# EAGLE design object_1 (EAGLE 7.7.0)
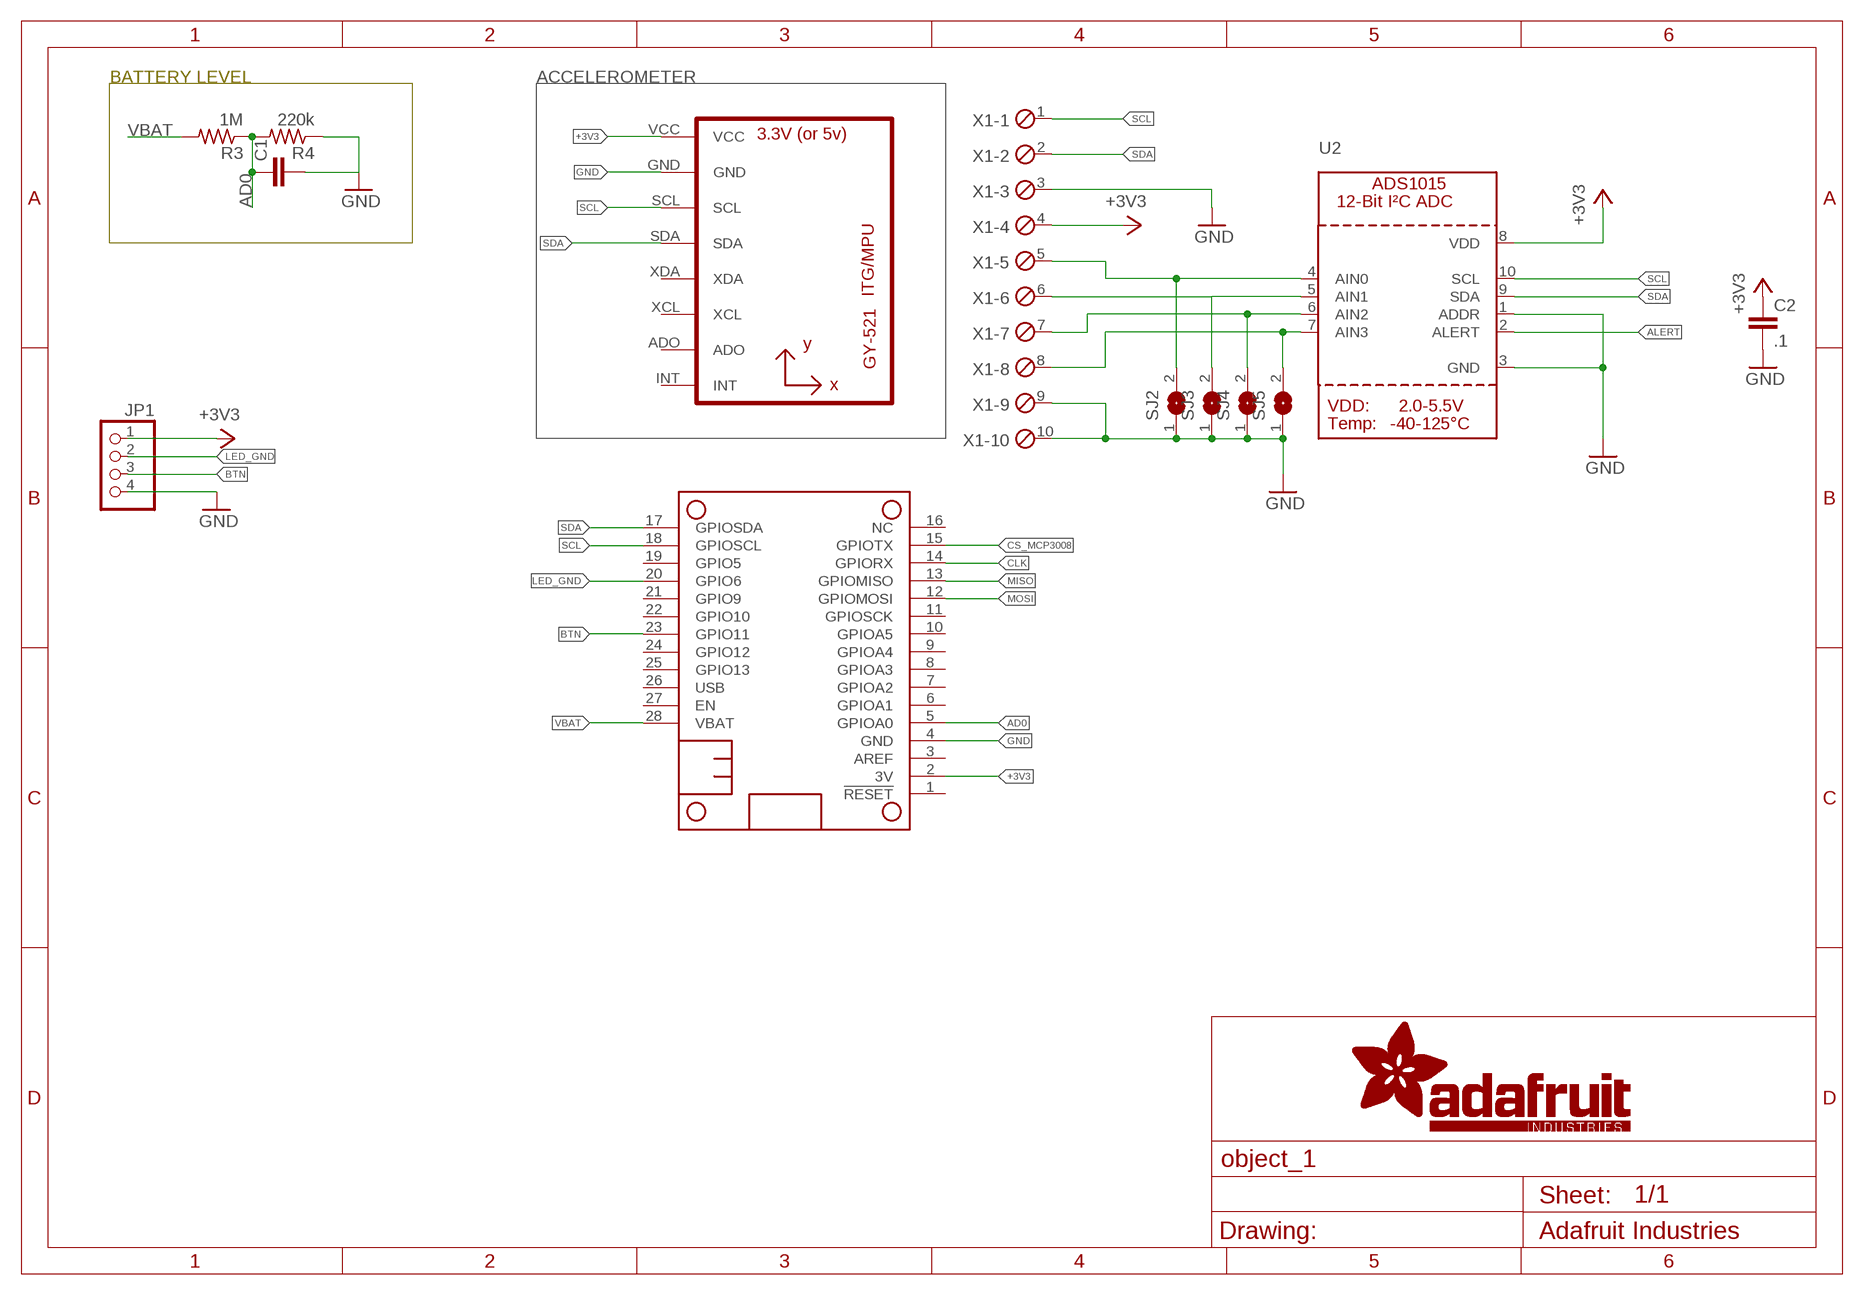
[diagram p0: schematic, sheet 1]

## Parts
C1  C-EUC0805K  [C0805K]
C2  .1  C-EUC0805K  [C0805K]
JP1  PINHD-1X4/90  [1X04/90]
MS1  FEATHERWING_NODIM  [FEATHERWING_DIM]
R3  1M  R-US_M0805  [M0805]
R4  220k  R-US_M0805  [M0805]
SJ2  SOLDERJUMPER  [SOLDERJUMPER_ARROW_NOPASTE]
SJ3  SOLDERJUMPER  [SOLDERJUMPER_ARROW_NOPASTE]
SJ4  SOLDERJUMPER  [SOLDERJUMPER_ARROW_NOPASTE]
SJ5  SOLDERJUMPER  [SOLDERJUMPER_ARROW_NOPASTE]
U1  GY-521MPU6050  [GY-521]
U2  ADC_ADS1015  [MSOP10]
X1  MPT10  [10POL254]

## Nets
+3V3: C2.1 JP1.1 MS1.2(3V) U1.VCC U2.8(VDD) X1.4
AD0: C1.1 MS1.5(GPIOA0) R3.1 R4.2
ALERT: U2.2(ALERT)
BTN: JP1.3 MS1.23(GPIO11)
CLK: MS1.14(GPIORX)
CS_MCP3008: MS1.15(GPIOTX)
GND: C1.2 C2.2 JP1.4 MS1.4(GND) R4.1 SJ2.1 SJ3.1 SJ4.1 SJ5.1 U1.GND U2.1(ADDR) U2.3(GND) X1.3 X1.9 X1.10
LED_GND: JP1.2 MS1.20(GPIO6)
MISO: MS1.13(GPIOMISO)
MOSI: MS1.12(GPIOMOSI)
N$2: SJ2.2 U2.4(AIN0) X1.5
N$3: SJ3.2 U2.5(AIN1) X1.6
N$4: SJ4.2 U2.6(AIN2) X1.7
N$5: SJ5.2 U2.7(AIN3) X1.8
SCL: MS1.18(GPIOSCL) U1.SCL U2.10(SCL) X1.1
SDA: MS1.17(GPIOSDA) U1.SDA U2.9(SDA) X1.2
VBAT: MS1.28(VBAT) R3.2
Unconnected: MS1.1(!RESET) MS1.3(AREF) MS1.6(GPIOA1) MS1.7(GPIOA2) MS1.8(GPIOA3) MS1.9(GPIOA4) MS1.10(GPIOA5) MS1.11(GPIOSCK) MS1.16(NC) MS1.19(GPIO5) MS1.21(GPIO9) MS1.22(GPIO10) MS1.24(GPIO12) MS1.25(GPIO13) MS1.26(USB) MS1.27(EN) U1.ADO U1.INT U1.XCL U1.XDA

## Notes on the sheet
- BATTERY LEVEL | ACCELEROMETER

## Library data of the parts
C1 C2 = rcl:C-EU: CAPACITOR, European symbol
JP1 = pinhead:PINHD-1X4: PIN HEADER
MS1 = adafruit:FEATHERWING
R3 R4 = resistor:R-US_: RESISTOR, American symbol
SJ2-SJ5 = microbuilder:SOLDERJUMPER: SMD Solder JUMPER Solder the two pads together to create a connection, or remove the solder to break it. REFLOW - Use this footprint for solder paste and reflow ovens. WAVE - Use this footprint for hand-soldering (larger pads). CLOSED - Has a trace between the two pads to ensure it is closed by default. The trace needs to be cut to disable the jumper, and can be closed again by creating a solder bridge between the two pads.; BOM: EXCLUDE
U1 = gy-521:GY-521
U2 = microbuilder:ADC_ADS1015: ADS1015 - 12-bit 4-Channel I2C ADC with Internal PGA VDD: 2.0-5.5V Sampling Rate: 3.3ksps Gain Settings: 2/3, 1, 2, 4, 8, 16 I2C Address: ADDR low = 1001000x, ADDR high = 1001001x Internal Comparator The ADS1015 includes an internal comparator that can be set to output a high-level on ALERT when the conversion results exceeeds a pre-defined upper level, and will deassert itself when the level falls below a pre-defined lower threshold level. It can also be set to windowed mode where the ALERT pin will be asserted if the data exceeds the upper threshold or falls below the lower threshold.
X1 = con-phoenix-254:MPT10: PHOENIX CONNECTOR; OC_FARNELL: unknown; OC_NEWARK: unknown

## Board
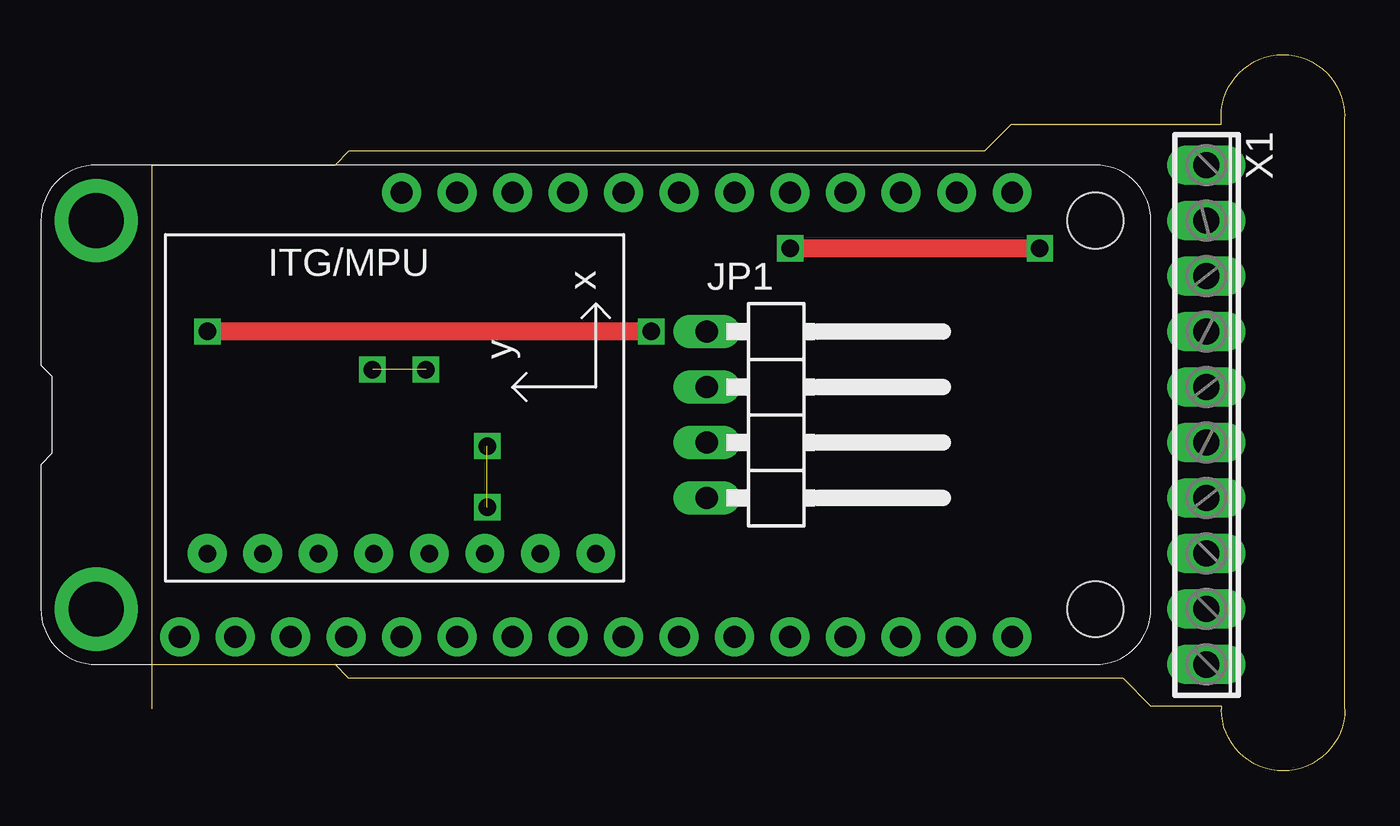
[diagram p1: board, top side]
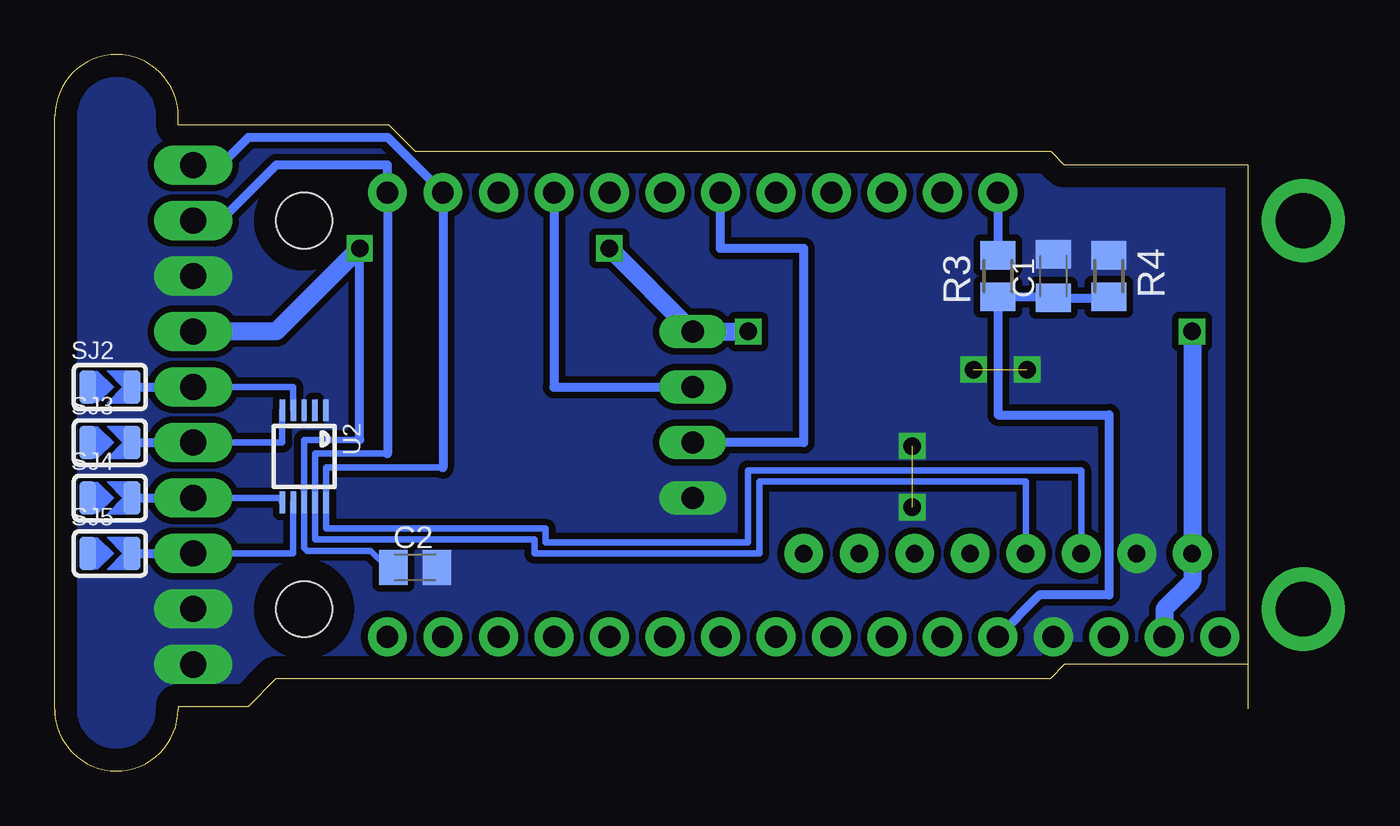
[diagram p2: board, bottom side, seen from below]

Size 54.6 x 32.79 mm. Coordinates in mm from the lower left corner, seen from the top.
Outline: 54.59,2.84 54.59,29.94
Outline: 0,4.87 0,27.73 8.38,27.73 9.02,28.37 38.1,28.37 39.31,29.57 48.93,29.57 48.93,29.95
Outline: 0,4.87 0,2.84
Outline: 48.94,29.96 arc-180 54.59,29.96
Outline: 54.6,2.82 arc-180 48.95,2.83
Outline: 0,4.87 8.38,4.87 9.02,4.24 44.45,4.24 45.72,2.97 48.95,2.97 48.95,2.81
Copper layers (1*16): Top 0.035mm / dielectric 1.5mm / Bottom 0.035mm
Design rules "default": minimum track width 10mil, minimum drill 24mil, track to track 8mil, track to pad 8mil, pad to pad 8mil, via to via 8mil, smd to smd 8mil, copper to edge 40mil, drill to drill 8mil, minimum pad ring 10mil, minimum via ring 8mil, stop-mask expansion 4mil, vias tented up to drill 0mil, thermal gap 10mil

### Footprints (pad centres in the part's own frame; a part is rotated, then mirrored left to right if it is on the bottom)
C0805K = smd 1.3 x 1.6: 1 -1,0; 2 1,0
1X04/90 = drill 1.016 long: 1 -3.81,-3.81; 2 -1.27,-3.81; 3 1.27,-3.81; 4 3.81,-3.81
FEATHERWING_DIM = drill 1 pad 1.778: 1 6.35,1.27; 2 8.89,1.27; 3 11.43,1.27; 4 13.97,1.27; 5 16.51,1.27; 6 19.05,1.27; 7 21.59,1.27; 8 24.13,1.27; 9 26.67,1.27; 10 29.21,1.27; 11 31.75,1.27; 12 34.29,1.27; 13 36.83,1.27; 14 39.37,1.27; 15 41.91,1.27; 16 44.45,1.27; 17 44.45,21.59; 18 41.91,21.59; 19 39.37,21.59; 20 36.83,21.59; 21 34.29,21.59; 22 31.75,21.59; 23 29.21,21.59; 24 26.67,21.59; 25 24.13,21.59; 26 21.59,21.59; 27 19.05,21.59; 28 16.51,21.59 | drill 2.5 pad 3.81: P$1 2.54,20.32; P$2 2.54,2.54 | hole 2.54: 48.26,20.32; 48.26,2.54
M0805 = smd 1.3 x 1.6: 1 -0.95,0; 2 0.95,0
SOLDERJUMPER_ARROW_NOPASTE = smd 0.762 x 1.524: 1 -1.016,0; 2 1.016,0
GY-521 = drill 0.8 pad 1.778: ADO -10.16,-6.35; GND -10.16,6.35; INT -10.16,-8.89; SCL -10.16,3.81; SDA -10.16,1.27; VCC -10.16,8.89; XCL -10.16,-3.81; XDA -10.16,-1.27
MSOP10 = smd 0.25 x 1: 1 -1,-2.113; 2 -0.5,-2.113; 3 0,-2.113; 4 0.5,-2.113; 5 1,-2.113; 6 1,2.113; 7 0.5,2.113; 8 0,2.113; 9 -0.5,2.113; 10 -1,2.113
10POL254 = drill 1.2 long: 1 -11.43,0; 2 -8.89,0; 3 -6.35,0; 4 -3.81,0; 5 -1.27,0; 6 1.27,0; 7 3.81,0; 8 6.35,0; 9 8.89,0; 10 11.43,0

### Placement (x,y rotation side)
C1  8.89,22.65 90 bottom
C2  38.1,9.32 0 bottom
JP1  29.21,16.3 270 top
MS1  -5.08,4.87 0 top
R3  11.43,22.65 90 bottom
R4  6.35,22.65 270 bottom
SJ2  52.07,17.57 0 bottom
SJ3  52.07,15.03 0 bottom
SJ4  52.07,12.49 0 bottom
SJ5  52.07,9.95 0 bottom
U1  11.43,20.11 90 top
U2  43.18,14.4 180 bottom
X1  48.26,16.3 270 top

### Tracks (layer width: path | path; a pad name or v marks a point on that pad's centre or on a via)
+3V3  (via drill 0.8)
  Top 0.813: v29.21,23.92 v40.64,23.92 | v22.86,20.11 v2.54,20.11
  Bottom 0.305: 40.64,15.16 43.18,15.16 U2.8 43.18,10.21 43.05,10.08 40.13,10.08 39.37,9.32 C2.1
  Bottom 0.406: 40.64,15.16 v40.64,23.92
  Bottom 0.813: v29.21,23.92 JP1.1 v22.86,20.11 | v2.54,20.11 U1.VCC 2.54,8.68 3.81,7.41 MS1.2 | 46.99,20.11 X1.4 44.45,20.11 v40.64,23.92
AD0
  Bottom 0.406: R4.2 6.4,21.65 C1.1 8.94,21.7 R3.1 11.43,16.3 6.35,16.3 6.35,8.05 9.53,8.05 MS1.5
BTN
  Bottom 0.406: JP1.3 20.32,15.03 20.32,23.92 24.13,23.92 MS1.23
GND  (via drill 0.8)  (2 unrouted)
  other vias: 10.1,18.37 12.55,18.37 15.35,14.87 15.35,12.07
  pour Bottom (isolate 0.305, no thermals): -1.27,-4.02 55.88,-4.02 55.88,35.35 -1.27,35.35
LED_GND
  Bottom 0.406: MS1.20 31.75,17.57 JP1.2
N$2
  Bottom 0.305: X1.5 43.68,17.57 U2.4
  Bottom 0.406: SJ2.2 X1.5
N$3
  Bottom 0.305: X1.6 44.18,15.03 U2.5
  Bottom 0.406: SJ3.2 X1.6
N$4
  Bottom 0.305: U2.6 44.31,12.49 X1.7
  Bottom 0.406: SJ4.2 X1.7
N$5
  Bottom 0.305: U2.7 43.68,9.95 X1.8
  Bottom 0.406: SJ5.2 X1.8
SCL
  Bottom 0.305: 36.83,13.89 42.18,13.89 U2.10 42.18,11.09 32.13,11.09 32.13,10.46 22.86,10.46 22.86,13.76 7.62,13.76 U1.SCL
  Bottom 0.406: 36.83,13.89 MS1.18 39.37,29 45.72,29 46.99,27.73 X1.1
SDA
  Bottom 0.305: 39.37,14.52 42.68,14.52 U2.9 42.68,10.59 32.64,10.59 32.64,9.95 22.35,9.95 22.35,13.25 10.16,13.25 U1.SDA
  Bottom 0.406: 39.37,14.52 MS1.17 39.37,27.73 44.45,27.73 46.99,25.19 X1.2
VBAT
  Bottom 0.406: MS1.28 R3.2